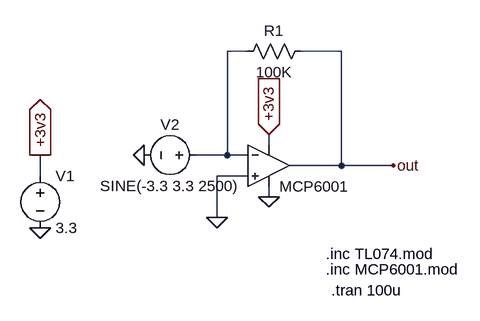
[diagram p0: schematic Draft3.asc]
Draft3.asc, the LTspice schematic file:
Version 4
SHEET 1 980 680
WIRE 656 192 624 192
WIRE 800 192 736 192
WIRE 688 336 688 320
WIRE 624 352 624 192
WIRE 624 352 576 352
WIRE 656 352 624 352
WIRE 800 368 800 192
WIRE 800 368 720 368
WIRE 880 368 800 368
WIRE 336 384 336 352
WIRE 656 384 608 384
WIRE 688 416 688 400
WIRE 608 448 608 384
FLAG 336 352 +3v3
IOPIN 336 352 Out
FLAG 336 464 0
FLAG 688 320 +3v3
IOPIN 688 320 In
FLAG 688 416 0
FLAG 496 352 0
FLAG 608 448 0
FLAG 880 368 out
SYMBOL voltage 336 368 R0
SYMATTR InstName V1
SYMATTR Value 3.3
SYMBOL OpAmps/opamp2 688 304 R0
WINDOW 0 16 32 Invisible 2
SYMATTR InstName U2
SYMATTR Value MCP6001
SYMBOL voltage 592 352 R90
WINDOW 0 -32 56 VBottom 2
WINDOW 3 32 56 VTop 2
SYMATTR InstName V2
SYMATTR Value SINE(-3.3 3.3 2500)
SYMBOL res 752 176 R90
WINDOW 0 0 56 VBottom 2
WINDOW 3 32 56 VTop 2
SYMATTR InstName R1
SYMATTR Value 100K
TEXT 776 504 Left 2 !.inc TL074.mod
TEXT 784 560 Left 2 !.tran 100u
TEXT 776 528 Left 2 !.inc MCP6001.mod

The netlist it stands for:
* Draft3.asc
V1 +3v3 0 3.3
XU2 0 N001 +3v3 0 out MCP6001  ; pins In+ In- V+ V- OUT
V2 N001 0 SINE(-3.3 3.3 2500)
R1 out N001 100K
.inc TL074.mod
.tran 100u
.inc MCP6001.mod
.backanno
.end